# EAGLE design piezo-preamp-tickler_V2-RevG (EAGLE 8.3.1)

## Sheet 1 of 2
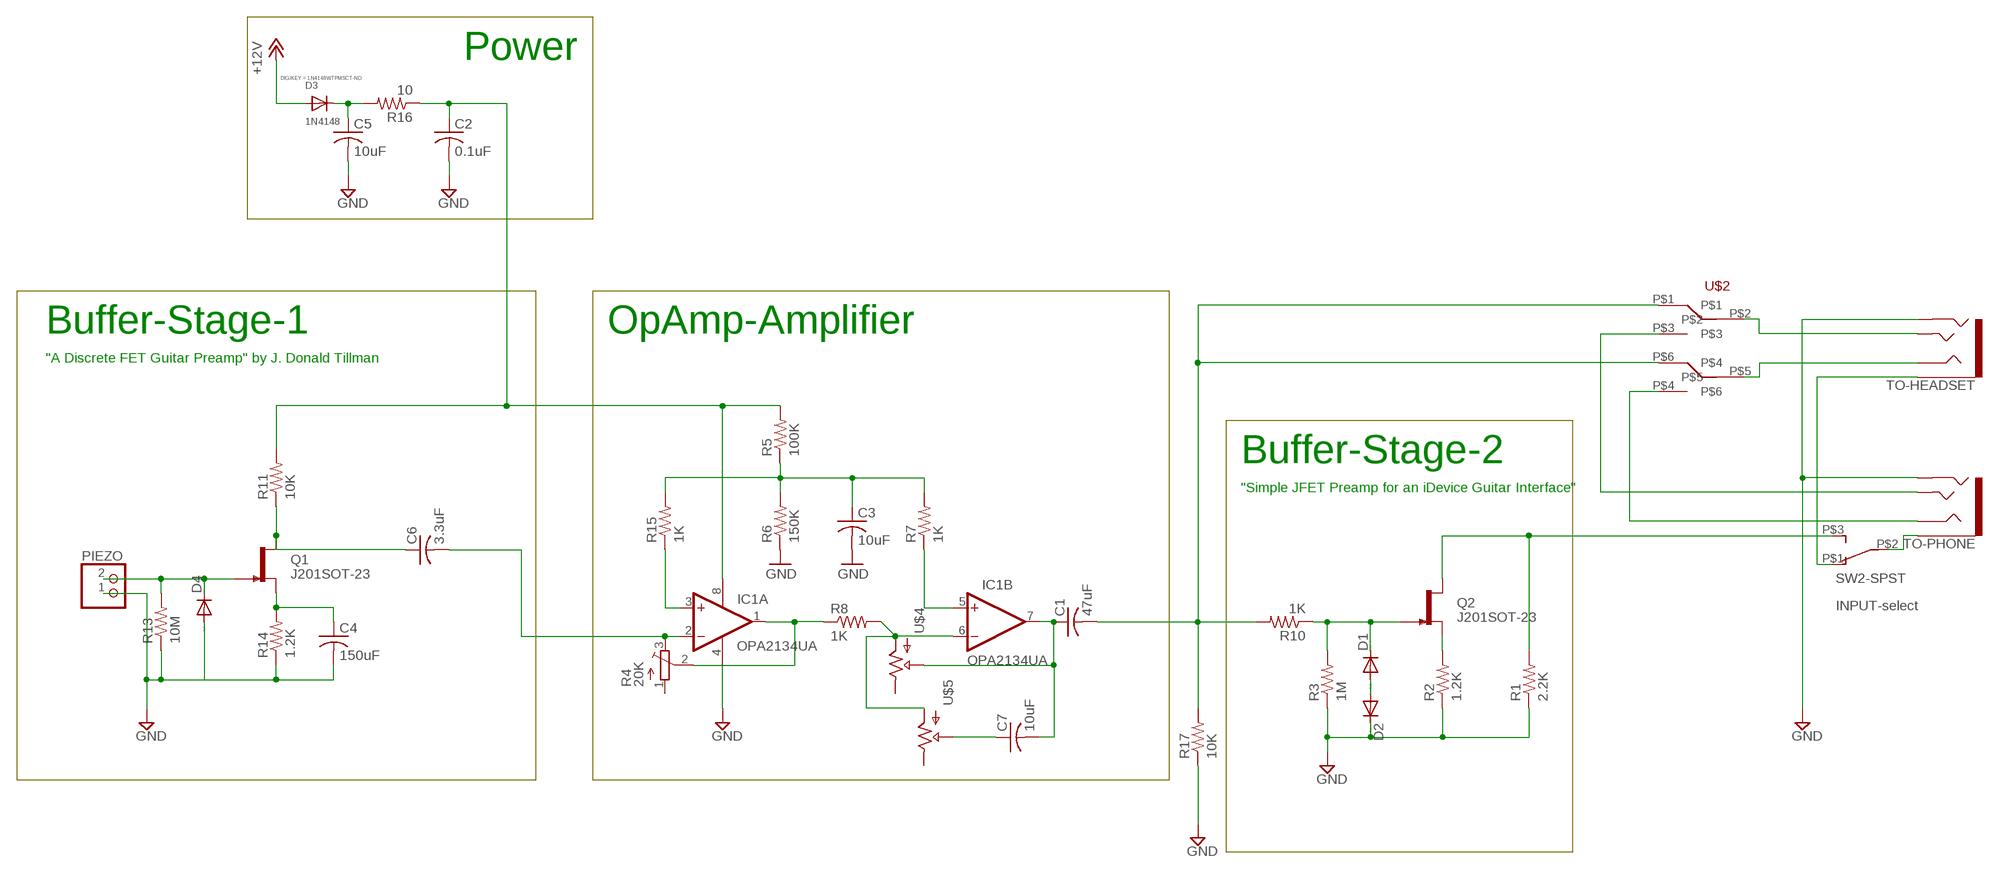
[diagram p0: schematic, sheet 1]

### Parts
C1  47uF  C-US  [CT7343]
C2  0.1uF  C-USC0805K  [C0805K]
C3  10uF  C-USC0805K  [C0805K]
C4  150uF  C-US  [CT7343]
C5  10uF  C-USC0805K  [C0805K]
C6  3.3uF  C-US  [CT7343]
C7  10uF  C-USC0805K  [C0805K]
D1  DIODE-SOD123  [SOD123]
D2  DIODE-SOD123  [SOD123]
D3  1N4148  DIODESOD-123  [SOD-123]
D4  DIODE-SOD123  [SOD123]
IC1  OPA2134UA  [SO08]
PIEZO  JST_2PIN-THM  [JST-PH-2-THM]
Q1  J201SOT-23  [SOT23-3]
Q2  J201SOT-23  [SOT23-3]
R1  2.2K  R-US_R0603  [R0603]
R2  1.2K  R-US_R0603  [R0603]
R3  1M  R-US_R0603  [R0603]
R4  20K  TRIMPOTTC33X  [TC33X]
R5  100K  R-US_R0603  [R0603]
R6  150K  R-US_R0603  [R0603]
R7  1K  R-US_R0603  [R0603]
R8  1K  R-US_R0603  [R0603]
R10  1K  R-US_R0603  [R0603]
R11  10K  R-US_R0603  [R0603]
R13  10M  R-US_R0603  [R0603]
R14  1.2K  R-US_R0603  [R0603]
R15  1K  R-US_R0603  [R0603]
R16  10  R-US_R0603  [R0603]
R17  10K  R-US_R0603  [R0603]
SW2-SPST  INPUT-select  SWITCH_SPDTCL-SB-12B  [SWITCH_SPDT_CL-SB-12B]
TO-HEADSET  AUDIO-JACK3LGPADS  [AUDIO-JACK-TRRS-SMD]
TO-PHONE  AUDIO-JACK3LGPADS  [AUDIO-JACK-TRRS-SMD]
U$2  SWITCH_DPDT  [SWITCH_DPDT_CL-SB-12B]
U$4  POTTHUMBPOT14MM  [THUMBPOT10MM]
U$5  POTTHUMBPOT14MM  [THUMBPOT10MM]

### Nets
+12V: D3.A ; also sheet 2
GND: C2.2 C3.2 C4.- C5.2 D2.C D4.A IC1.4(A:V-) PIEZO.1 R1.1 R2.1 R3.1 R6.1 R13.1 R14.1 R17.1 TO-HEADSET.RING2 TO-PHONE.RING2 ; also sheet 2
N$1: D1.A D2.A
N$2: D4.C PIEZO.2 Q1.3(G) R13.2
N$3: Q2.2(S) R2.2
N$5: IC1.5(B:+IN) R7.1
N$6: C1.+ C7.2 IC1.7(B:OUT) U$4.P$2(WIPER)
N$7: IC1.6(B:-IN) R8.2 U$4.P$1(IN) U$5.P$1(IN)
N$9: C6.+ Q1.1(D) R11.1
N$10: D1.C Q2.3(G) R3.2 R10.1
N$11: C1.- R10.2 R17.2 U$2.P$1 U$2.P$6
N$12: SW2-SPST.P$1 TO-HEADSET.EARTH
N$13: TO-HEADSET.TIP U$2.P$2
N$14: C4.+ Q1.2(S) R14.2
N$15: TO-HEADSET.RING1 U$2.P$5
N$16: C5.1 D3.C R16.2
N$17: SW2-SPST.P$2 TO-PHONE.EARTH
N$22: IC1.3(A:+IN) R15.1
N$23: C3.1 R5.1 R6.2 R7.2 R15.2
N$24: IC1.1(A:OUT) R4.2(S) R8.1
N$25: C2.1 IC1.8(A:V+) R5.2 R11.2 R16.1
N$26: TO-PHONE.RING1 U$2.P$4
N$27: TO-PHONE.TIP U$2.P$3
N$28: C6.- IC1.2(A:-IN) R4.3(E)
N$31: C7.1 U$5.P$2(WIPER)
SELECT: Q2.1(D) R1.2 SW2-SPST.P$3
Unconnected: R4.1(A) U$4.P$3(OUT) U$5.P$3(OUT)

### Notes on the sheet
- Power
- Buffer-Stage-1 | OpAmp-Amplifier
- "A Discrete FET Guitar Preamp" by J. Donald Tillman
- Buffer-Stage-2
- "Simple JFET Preamp for an iDevice Guitar Interface"

## Sheet 2 of 2
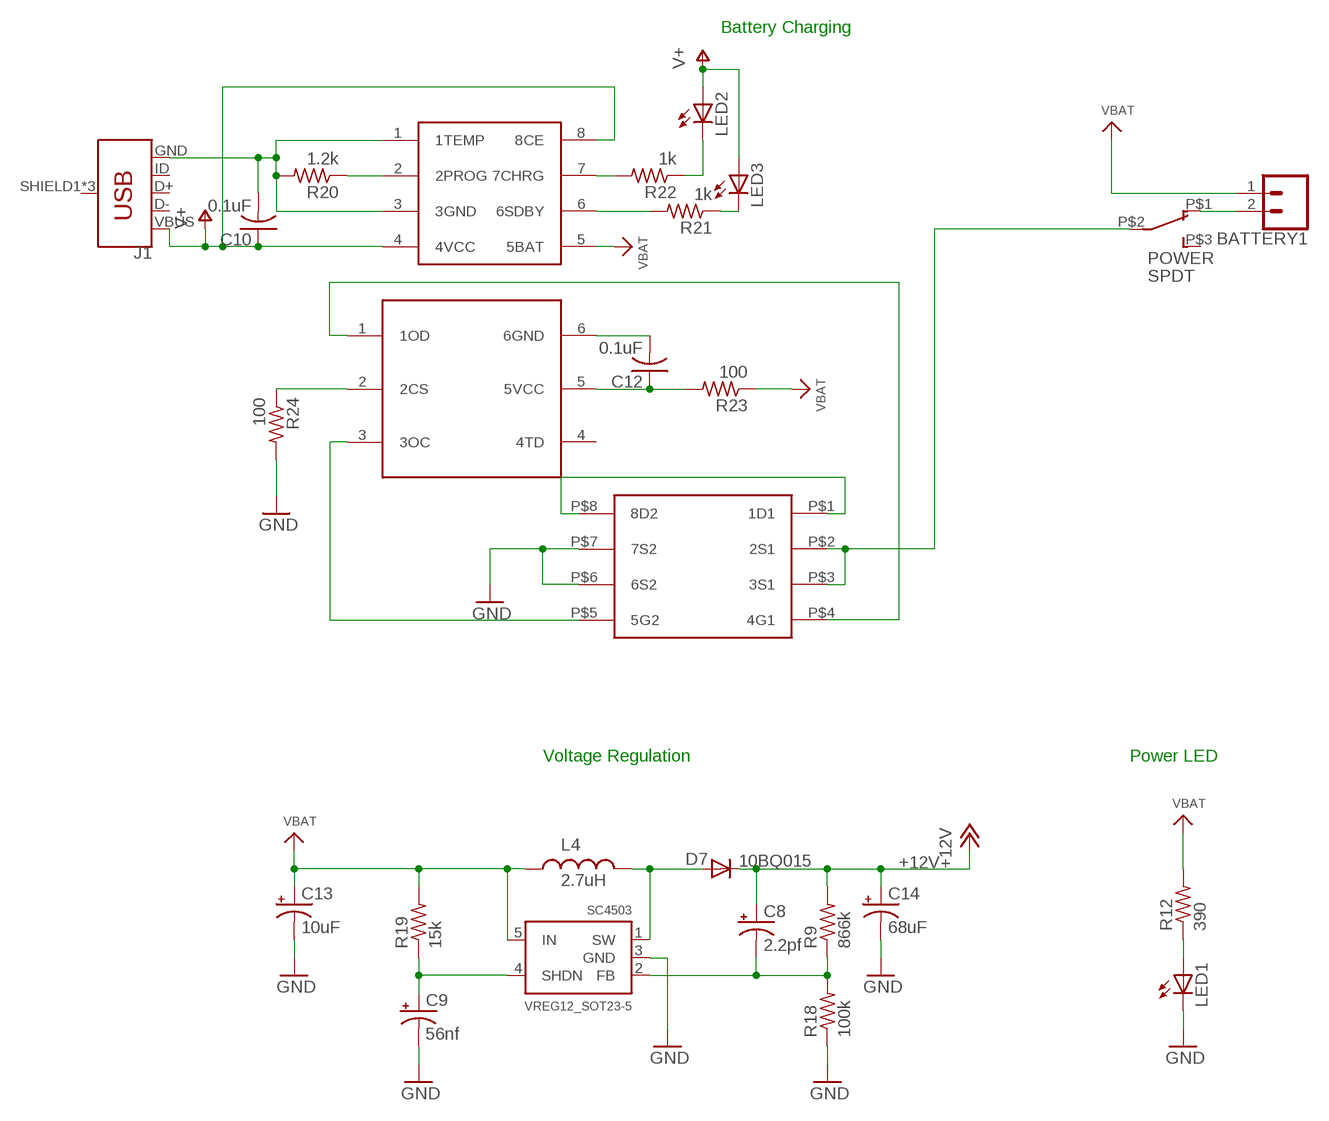
[diagram p1: schematic, sheet 2]

### Parts
BATTERY1  CONN_02LOCK  [1X02_LOCK]
C8  2.2pf  CAP_POL1206  [EIA3216]
C9  56nf  CAP_POL3528  [EIA3528]
C10  0.1uF  C-USC0805K  [C0805K]
C12  0.1uF  C-USC0805K  [C0805K]
C13  10uF  CAP_POL1206  [EIA3216]
C14  68uF  CAP_POL3528  [EIA3528]
D7  10BQ015  DIODESMA  [SMA-DIODE]
DW01A  DW01A  [SOT23-6]
F8205A  F8205A  [F8205A]
J1  USB_MICRO-BREDUCED_PASTE  [USB-B-MICRO-SMD_RED_PASTE]
L4  2.7uH  INDUCTORCR54  [CR54]
LED1  LED3MM  [LED3MM]
LED2  LED3MM  [LED3MM]
LED3  LED3MM  [LED3MM]
POWER  SPDT  SWITCH_SPDTCL-SB-12B  [SWITCH_SPDT_CL-SB-12B]
R9  866k  R-US_R0603  [R0603]
R12  390  R-US_R0805  [R0805]
R18  100k  R-US_R0603  [R0603]
R19  15k  R-US_R0603  [R0603]
R20  1.2k  R-US_R0603  [R0603]
R21  1k  R-US_R0603  [R0603]
R22  1k  R-US_R0603  [R0603]
R23  100  R-US_R0603  [R0603]
R24  100  R-US_R0603  [R0603]
SC4503  VREG12_SOT23-5  [SOT23-5]
TP4056  TP4056-CHIP  [SO08]

### Nets
+12V: C8.A(+) C14.A(+) D7.C R9.2 ; also sheet 1
GND: C9.C(-) C13.C(-) C14.C(-) F8205A.P$6(6S2) F8205A.P$7(7S2) LED1.K(C) R18.1 R24.2 SC4503.3(GND) ; also sheet 1
N$18: LED1.A R12.1
N$20: F8205A.P$2(2S1) F8205A.P$3(3S1) POWER.P$2
N$21: BATTERY1.2 POWER.P$1
N$29: C9.A(+) R19.1 SC4503.4(SHDN)
N$30: C8.C(-) R9.1 R18.2 SC4503.2(FB)
N$32: D7.A L4.P$2 SC4503.1(SW)
N$33: C10.2 J1.GND R20.2 TP4056.1(1TEMP) TP4056.3(3GND)
N$34: DW01A.1(1OD) F8205A.P$4(4G1)
N$35: R20.1 TP4056.2(2PROG)
N$36: DW01A.3(3OC) F8205A.P$5(5G2)
N$37: R22.2 TP4056.7(7CHRG)
N$38: R21.2 TP4056.6(6SDBY)
N$39: LED3.K(C) R21.1
N$40: LED2.K(C) R22.1
N$41: C12.1 DW01A.5(5VCC) R23.2
N$42: C12.2 DW01A.6(6GND)
N$43: DW01A.2(2CS) R24.1
N$44: F8205A.P$1(1D1) F8205A.P$8(8D2)
V+: C10.1 J1.VBUS LED2.A LED3.A TP4056.4(4VCC) TP4056.8(8CE)
VBAT: BATTERY1.1 C13.A(+) L4.P$1 R12.2 R19.2 R23.1 SC4503.5(IN) TP4056.5(5BAT)
Unconnected: DW01A.4(4TD) J1.D+ J1.D- J1.ID J1.SHIELD1(SHIELD) J1.SHIELD2(SHIELD) J1.SHIELD3(SHIELD) POWER.P$3

### Notes on the sheet
- Battery Charging
- Voltage Regulation | Power LED

## Library data of the parts
BATTERY1 = SparkFun-Connectors:CONN_02: Multi connection point. Often used as Generic Header-pin footprint for 0.1 inch spaced/style header connections On any of the 0.1 inch spaced packages, you can populate with these: Break Away Headers - Straight <https://www.sparkfun.com/products/116> (PRT-00116) Break Away Male Headers - Right Angle <https://www.sparkfun.com/products/553> (PRT-00553) Female Headers <https://www.sparkfun.com/products/115> (PRT-00115) Break Away Headers - Machine Pin <https://www.sparkfun.com/products/117> (PRT-00117) Break Away Female Headers - Swiss Machine Pin <https://www.sparkfun.com/products/743> (PRT-00743) For SCREWTERMINALS and SPRING TERMINALS visit here: Screw Terimnals on SparkFun.com <https://www.sparkfun.com/search/results?term=Screw+Terminals> (5mm/3.5mm/2.54mm spacing) This device is also useful as a general connection point to wire up your design to another part of your project. Our various solder wires solder well into these plated through hole pads. Hook-Up Wire - Assortment (Stranded, 22 AWG) <https://www.sparkfun.com/products/11375> (PRT-11375) Hook-Up Wire - Assortment (Solid Core, 22 AWG) <https://www.sparkfun.com/products/11367> (PRT-11367) View the entire wire category on our website here <https://www.sparkfun.com/categories/141> Special notes: Molex polarized connector foot print use with: PRT-08233 with associated crimp pins and housings. 2.54_SCREWTERM for use with PRT-10571. 3.5mm Screw Terminal footprints for PRT-08084 5mm Screw Terminal footprints for use with PRT-08432
C1-C7 C10 C12 = adafruit:C-US: CAPACITOR, American symbol
C8 C9 C13 C14 = SparkFun:CAP_POL: Capacitor Polarized These are standard SMD and PTH capacitors. Normally 10uF, 47uF, and 100uF in electrolytic and tantalum varieties. Always verify the external diameter of the through hole cap, it varies with capacity, voltage, and manufacturer. The EIA devices should be standard.
D1 D2 D4 = diode:DIODE-: DIODE
D3 = adafruit:DIODE: Diode; DIGIKEY: 1N4148WTPMSCT-ND
D7 = SparkFun:DIODE: Diode
DW01A = CMU-ArtFab:DW01A
F8205A = CMU-ArtFab:F8205A
IC1 = linear:OPA2*: Dual Operational Amplifier Low Power, Single-Supply, Rail-To-Rail Operational Amplifier Source: http://focus.ti.com/lit/ds/symlink/opa2345.pdf http://focus.ti.com .. opa241.pdf http://focus.ti.com/lit/ds/symlink/opa2134.pdf
J1 = SparkFun-Connectors:USB_MICRO-B: USB Type Micro-B Connector Male/female and PTH/SMT variants SparkFun Products: SparkFun microB USB Breakout <https://www.sparkfun.com/products/12035> SparkFun USB microB Plug Breakout <https://www.sparkfun.com/products/10031> SparkFun ESP8266 Thing <https://www.sparkfun.com/products/13231>; PROD_ID: CONN-11752
L4 = SparkFun:INDUCTOR: Inductors Basic Inductor/Choke - 0603 and 1206. Footprints are not proven and vary greatly between part numbers.
LED1-LED3 = led:LED: LED OSRAM: - CHIPLED LG R971, LG N971, LY N971, LG Q971, LY Q971, LO R971, LY R971 LH N974, LH R974 LS Q976, LO Q976, LY Q976 LO Q996 - Hyper CHIPLED LW Q18S LB Q993, LB Q99A, LB R99A - SideLED LS A670, LO A670, LY A670, LG A670, LP A670 LB A673, LV A673, LT A673, LW A673 LH A674 LY A675 LS A676, LA A676, LO A676, LY A676, LW A676 LS A679, LY A679, LG A679 - Hyper Micro SIDELED® LS Y876, LA Y876, LO Y876, LY Y876 LT Y87S - SmartLED LW L88C, LW L88S LB L89C, LB L89S, LG L890 LS L89K, LO L89K, LY L89K LS L896, LA L896, LO L896, LY L896 - TOPLED LS T670, LO T670, LY T670, LG T670, LP T670 LSG T670, LSP T670, LSY T670, LOP T670, LYG T670 LG T671, LOG T671, LSG T671 LB T673, LV T673, LT T673, LW T673 LH T674 LS T676, LA T676, LO T676, LY T676, LB T676, LH T676, LSB T676, LW T676 LB T67C, LV T67C, LT T67C, LS T67K, LO T67K, LY T67K, LW E67C LS E67B, LA E67B, LO E67B, LY E67B, LB E67C, LV E67C, LT E67C LW T67C LS T679, LY T679, LG T679 LS T770, LO T770, LY T770, LG T770, LP T770 LB T773, LV T773, LT T773, LW T773 LH T774 LS E675, LA E675, LY E675, LS T675 LS T776, LA T776, LO T776, LY T776, LB T776 LHGB T686 LT T68C, LB T68C - Hyper Mini TOPLED® LB M676 - Mini TOPLED Santana® LG M470 LS M47K, LO M47K, LY M47K Source: http://www.osram.convergy.de LUXEON: - LUMILED® LXK2-PW12-R00, LXK2-PW12-S00, LXK2-PW14-U00, LXK2-PW14-V00 LXK2-PM12-R00, LXK2-PM12-S00, LXK2-PM14-U00 LXK2-PE12-Q00, LXK2-PE12-R00, LXK2-PE12-S00, LXK2-PE14-T00, LXK2-PE14-U00 LXK2-PB12-K00, LXK2-PB12-L00, LXK2-PB12-M00, LXK2-PB14-N00, LXK2-PB14-P00, LXK2-PB14-Q00 LXK2-PR12-L00, LXK2-PR12-M00, LXK2-PR14-Q00, LXK2-PR14-R00 LXK2-PD12-Q00, LXK2-PD12-R00, LXK2-PD12-S00 LXK2-PH12-R00, LXK2-PH12-S00 LXK2-PL12-P00, LXK2-PL12-Q00, LXK2-PL12-R00 Source: www.luxeon.com KINGBRIGHT: KA-3528ASYC Source: www.kingbright.com
PIEZO = adafruit:JST_2PIN: JST 2-Pin Connectors of various flavors SMT-RA (S2B-PH-SM4) 4UConnector #17311 SMT (B2B-PH-SM4) THM-RA (S2B-PH) THM (B2B-PH)
POWER SW2-SPST = CMU-ArtFab:SWITCH_SPDT
Q1 Q2 = CMU-ArtFab:J201: N-channel JFET
R1-R3 R5-R24 = CMU-ArtFab:R-US_: RESISTOR, American symbol
R4 = adafruit:TRIMPOT: SMT trimmer potentiometer part number TC33X http://www.ladyada.net/library/eagle
SC4503 = CMU-ArtFab:VREG12_SOT23-5: SOT23-5 Fixed Voltage Regulators To better organise some of the SOT23-5 fixed voltage regulators in this library, this new part was created. Part Current Out V Out V In V Dropout Digikey Part No. ADP121 150mA 3.3V 3.4-5.5V 0.09V @ 150mA ADP121-AUJZ33R7CT-ND ADP121 150mA 3.0V 3.1-5.5V 0.09V @ 150mA ADP121-AUJZ30R7CT-ND ADP122 300mA 3.3V 3.4-5.5V 0.085V @ 300mA ADP122AUJZ-3.3-R7CT-ND ADP1712 300mA 3.3V 3.5-5.5V 0.17V @ 300mA ADP1712AUJZ-3.3-R7TR-ND AP7311 (Low Cost) 150mA 3.3V 3.5-6V 0.15V @ 150mA AP7311-33WG-7DICT-ND LD39015M18R 150mA 1.8V 1.9V-5.5V 0.08V @ 100mA 497-6977-1-ND MCP1824T-3302E/OT 300mA 3.3V 3.5V-6V 0.2V @ 300mA MCP1824T-3302E/OTCT-ND MIC5205-2.5YM5 TR 150mA 2.5V 2.7-16V 0.165V @ 150mA 576-1257-2-ND MIC5205-3.0YM5 TR 150mA 3.0V 3.2V-16V 0.165V @ 150mA 576-1258-2-ND MIC5205-3.3YM5 TR 150mA 3.3V 3.5V-16V 0.165V @ 150mA 576-1259-2-ND TPS780330220 150mA 3.3V+2.2V 3.6-5.5V 250mV Max 296-23332-1-ND TDA3663/N1,135 100mA 3.3V 3.5-45V 0.18V @ 50mA 568-5343-1-ND
TO-HEADSET TO-PHONE = Daniel:AUDIO-JACK3: Audio jack - 3.5mm TRRS variety - two rings.
TP4056 = CMU-ArtFab:TP4056-CHIP
U$2 = CMU-ArtFab:SWITCH_DPDT
U$4 U$5 = CMU-ArtFab:POT

## Board
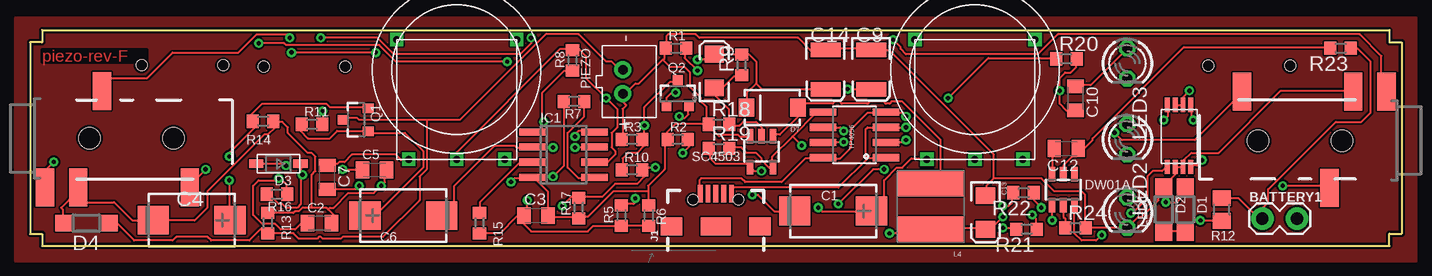
[diagram p2: board, top side]
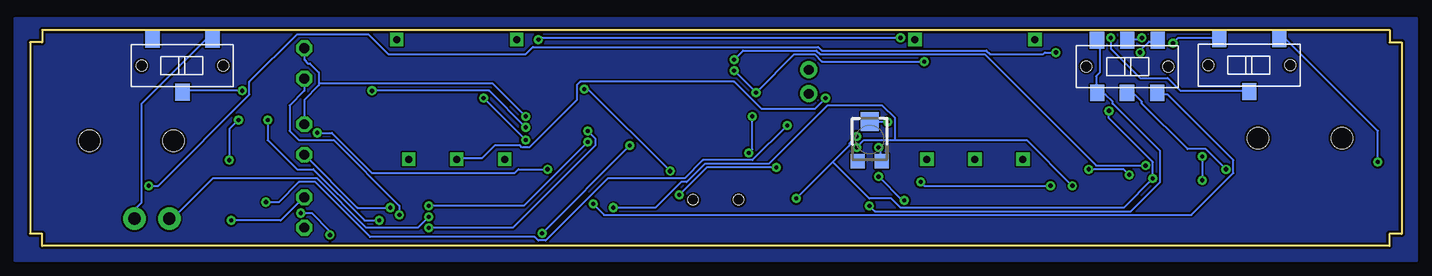
[diagram p3: board, bottom side, seen from below]

Size 114.3 x 18.03 mm. Coordinates in mm from the lower left corner, seen from the top.
Outline: 0,17 0,1 1.02,1 1.02,0 113.28,0 113.28,1.02 114.3,1.02 114.3,17 113.28,17 113.28,18.03 1,18.03 1,17 0,17
Copper layers (1*16): Top 0.035mm / dielectric 1.5mm / Bottom 0.035mm
Design rules "default *": minimum track width 6mil, minimum drill 0.35mm, track to track 6mil, track to pad 6mil, pad to pad 6mil, via to via 6mil, smd to smd 6mil, copper to edge 8mil, drill to drill 6mil, minimum pad ring 10mil, minimum via ring 8mil, stop-mask expansion 4mil, vias tented up to drill 20mil, thermal gap 10mil

### Footprints (pad centres in the part's own frame; a part is rotated, then mirrored left to right if it is on the bottom)
1X02_LOCK = drill 1.016 pad 1.88: 1 -0.178,0; 2 2.718,0
CT7343 = smd 2.6 x 2.4: + 3.2,0; - -3.2,0
C0805K = smd 1.1 x 1.4: 1 -1,0; 2 1,0
EIA3216 = smd 1.4 x 1.6: A 1.4,0; C -1.4,0
EIA3528 = smd 1.2 x 2.5: A 1.65,0; C -1.65,0
SOD123 = smd 1.4 x 1.4: A 1.9,0; C -1.9,0
SOD-123 = smd 1.2 x 0.7: A 1.85,0; C -1.85,0
SMA-DIODE = smd 1.27 x 1.47: A -2.15,0; C 2.15,0
SOT23-6 = smd 0.55 x 1.2: 1 -0.95,-1.3; 2 0,-1.3; 3 0.95,-1.3; 4 0.95,1.3; 5 0,1.303; 6 -0.95,1.3
F8205A = smd 0.406 x 1.2: P$1 -0.975,-2.65; P$2 -0.325,-2.65; P$3 0.325,-2.65; P$4 0.975,-2.65; P$5 0.975,2.55; P$6 0.325,2.55; P$7 -0.325,2.55; P$8 -0.975,2.55
SO08 = smd 0.6 x 2.2: 1 -1.905,-2.6; 2 -0.635,-2.6; 3 0.635,-2.6; 4 1.905,-2.6; 5 1.905,2.6; 6 0.635,2.6; 7 -0.635,2.6; 8 -1.905,2.6
USB-B-MICRO-SMD_RED_PASTE = smd 1.45 x 0.4: D+ 2.725,0; D- 2.725,0.65; GND 2.725,-1.3; ID 2.725,-0.65; VBUS 2.725,1.3 | smd 1.5 x 1.8: SHIELD1 0,3.685; SHIELD2 0,-3.685 | smd 1.5 x 2.5: SHIELD3 0,0 | hole 0.85: 2.2,1.9; 2.2,-1.9
CR54 = smd 5.5 x 2.15: P$1 0,1.92; P$2 0,-1.92
LED3MM = drill 0.813 octagon: A -1.27,0; K 1.27,0
JST-PH-2-THM = drill 0.8 pad 1.422: 1 1,0; 2 -1,0
SWITCH_SPDT_CL-SB-12B = smd 1.2 x 1.4: P$1 -2.5,-2.2; P$2 0,2.2; P$3 2.5,-2.2 | hole 0.9: -3.4,0; 3.4,0
SOT23-3 = smd 0.8 x 0.9: 1 -0.95,-1; 2 0.95,-1; 3 0,1.1
R0603 = smd 1 x 1.1: 1 -0.85,0; 2 0.85,0
TC33X = smd 1.2 x 1.2: 1 -1,-1.825; 3 1,-1.825 | smd 1.5 x 1.6: 2 0,1.5
R0805 = smd 1.3 x 1.5: 1 -0.95,0; 2 0.95,0
SOT23-5 = smd 0.55 x 1.2: 1 -0.95,-1.3; 2 0,-1.3; 3 0.95,-1.3; 4 0.95,1.3; 5 -0.95,1.3
AUDIO-JACK-TRRS-SMD = smd 1.524 x 3.175: EARTH -2.114,-5.271; RING1 2.644,2.759; RING2 0.66,-5.271; TIP 9.948,-5.271 | hole 1.778: 1.6,-1.15; 8.6,-1.15
SO08' = smd 0.61 x 2.21: 1 -1.905,-2.616; 2 -0.635,-2.616; 3 0.635,-2.616; 4 1.905,-2.616; 5 1.905,2.616; 6 0.635,2.616; 7 -0.635,2.616; 8 -1.905,2.616
SWITCH_DPDT_CL-SB-12B = smd 1.2 x 1.4: P$1 -2.5,-2.2; P$2 -0.04,-2.2; P$3 2.5,-2.2; P$4 2.54,2.2; P$5 0,2.2; P$6 -2.54,2.2 | hole 0.9: -3.4,0; 3.4,0
THUMBPOT10MM = drill 0.6 square: P$1 0,-7.5; P$2 -4,-7.5; P$3 4,-7.5; P$4 -5,2.5; P$5 5,2.5

### Placement (x,y rotation side)
BATTERY1  102.87,2.29 0 top
C1  66.93,2.92 0 top
C2  24.13,1.91 0 top
C3  42.16,2.54 0 top
C4  13.46,2.16 0 top
C5  28.7,6.35 0 top
C6  31.11,2.54 180 top
C7  24.77,5.71 270 top
C8  57.02,14.61 90 top
C9  70.1,14.73 270 top
C10  87.12,12.32 270 top
C12  86.36,8.13 180 top
C13  79.63,2.79 270 top
C14  66.29,14.73 270 top
D1  96.27,3.05 270 top
D2  94.49,3.05 270 top
D3  20.7,6.86 180 top
D4  4.7,1.91 180 top
D7  61.85,11.56 180 top
DW01A  86.11,4.7 0 top
F8205A  95.76,9.14 180 top
IC1  44.45,7.62 270 top
J1  57.15,1.65 90 top
L4  75.06,3.3 180 top
LED1  91.44,2.79 270 top
LED2  91.44,8.89 270 top
LED3  91.44,15.24 270 top
PIEZO  49.4,13.72 270 top
POWER  101.6,15.04 180 bottom
Q1  27.18,10.54 90 top
Q2  53.98,12.7 0 top
R1  53.85,16.51 0 top
R2  53.98,8.89 0 top
R3  50.16,8.89 0 top
R4  44.32,8.89 0 bottom
R5  49.28,2.54 90 top
R6  51.56,2.54 270 top
R7  45.34,12.06 180 top
R8  45.21,15.49 90 top
R9  59.31,15.11 90 top
R10  50.16,6.35 0 top
R11  23.5,10.16 0 top
R12  99.31,3.05 90 top
R13  19.81,1.91 270 top
R14  19.43,10.41 180 top
R15  37.47,1.91 270 top
R16  20.57,4.32 180 top
R17  45.72,3.17 90 top
R18  57.4,10.16 0 top
R19  57.4,8.13 0 top
R20  86.36,15.62 0 top
R21  83.06,1.4 180 top
R22  82.8,4.45 180 top
R23  109.22,16.51 180 top
R24  87.12,1.52 0 top
SC4503  60.96,7.87 180 top
SW2-SPST  12.7,15.08 180 bottom
TO-HEADSET  3.37,10.16 0 top
TO-PHONE  110.94,7.62 180 top
TP4056  TP4056-CHIP  [SO08']  68.71,9.27 90 top
U$2  22.86,14.99 0 bottom
U$4  78.74,14.73 0 top
U$5  35.56,14.73 0 top

### Tracks (layer width: path | path; a pad name or v marks a point on that pad's centre or on a via)
+12V  (via drill 0.35)
  Top 0.152: D3.A 21.18,6.86 v21.34,6.71 | v55.63,15.54 56.54,15.54 57,16 C8.A 57.15,16 59.28,16 R9.2 59.44,16 59.89,16 60.5,15.39 60.5,13.56 | 60.5,13.56 59.74,12.8 59.74,11.58 D7.C | 60.5,13.56 60.96,13.11 66.29,13.11 C14.A
  Bottom 0.152: v21.34,6.71 25.45,6.71 34.75,16 48.46,16 48.77,16.31 54.86,16.31 v55.63,15.54
GND  (via drill 0.35)
  Top 0.152: 3.81,4.42 3.96,4.57 3.96,4.88 TO-HEADSET.RING2 3.81,4.42 | 3.81,4.42 2.59,3.2 2.74,3.05 2.74,1.98 D4.A | 3.81,4.42 4.57,3.66 7.01,3.66 8.53,2.13 10.21,2.13 C4.- 10.36,2.13 13.72,2.13 14.78,3.2 14.78,4.57 19.51,9.3 19.81,9.3 20.42,9.91 20.42,10.36 | 23.47,3.2 24.69,3.2 24.84,3.05 | 23.47,3.2 22.71,3.2 22.4,2.9 22.1,2.9 21.95,2.74 R13.1 | 24.84,3.05 25.3,2.59 25.3,2.13 25.15,1.98 C2.2 | 20.42,10.36 21.03,10.36 21.49,9.91 21.49,9.45 23.16,7.77 23.47,7.77 23.77,7.47 23.77,6.25 23.47,5.94 23.47,3.2 | 24.84,3.05 24.99,3.2 25.3,3.2 26.52,4.42 28.65,4.42 v29.26,5.03 29.57,5.33 29.57,6.25 C5.2 | 20.42,10.36 R14.1 | R3.1 49.38,8.99 49.38,11.43 49.68,11.73 49.38,12.04 49.38,12.65 PIEZO.1 49.53,12.65 50.44,13.56 50.75,13.56 52.73,15.54 | 52.73,15.54 52.88,15.7 52.88,16.46 R1.1 53.03,16.61 53.03,17.53 53.19,17.68 55.47,17.68 55.78,17.37 64.01,17.37 65.08,16.31 66.29,16.31 C14.C 66.29,16.46 70.1,16.46 C9.C 70.1,16.31 71.63,16.31 80.31,7.62 80.31,5.64 | 45.72,2.44 43.28,2.44 C3.2 43.13,2.59 43.13,4.57 41.91,5.79 IC1.4 41.76,5.64 40.39,5.64 v40.08,5.33 | 51.51,4.57 51.51,5.03 52.88,6.4 52.88,8.69 53.03,8.84 R2.1 53.03,8.99 53.03,9.45 53.8,10.21 56.39,10.21 | 51.51,4.57 51.51,3.5 R6.1 | 56.39,10.21 56.54,10.21 R18.1 | SC4503.3 59.89,9.14 59.13,9.14 58.98,9.3 57.61,9.3 57.45,9.14 56.54,10.06 R18.1 | 45.72,2.44 46.48,2.44 48.62,4.57 51.51,4.57 | 45.72,2.44 R17.1 | 52.73,15.54 53.34,14.94 54.56,14.94 55.02,14.48 55.02,13.26 55.93,12.34 55.78,12.19 56.39,11.58 56.39,10.21 | 56.39,10.21 R18.1 | 80.31,5.64 79.7,5.03 79.7,4.27 C13.C | 80.31,5.64 84.28,5.64 85.34,4.57 87.63,4.57 87.94,4.27 87.94,1.52 R24.2 LED1.K 92.35,2.44 92.66,2.44 94.03,3.81 94.03,3.96 94.49,4.42 D2.C 94.49,5.03 95.4,5.94 95.4,6.55 F8205A.P$6 95.56,6.55 96.01,6.55 F8205A.P$7 96.16,6.71 96.16,7.16 96.77,7.77 99.06,7.77 104.24,12.95 110.19,12.95 TO-PHONE.RING2
  Bottom 0.152: v29.26,5.03 39.78,5.03 v40.08,5.33
N$1
  Top 0.152: D2.A 94.49,1.22 96.16,1.22 D1.A
N$2
  Top 0.152: 33.07,10.52 35.81,10.52 42.98,17.68 45.72,17.68 48.01,15.39 48.46,15.39 49.07,14.78 49.38,14.78 PIEZO.2 | 33.07,10.52 27.43,10.52 27.28,10.67 26.21,10.67 Q1.3 | R13.2 21.95,1.07 22.4,0.61 23.93,0.61 24.08,0.76 24.23,0.76 24.38,0.61 25.91,0.61 26.06,0.76 29.41,0.76 32.46,3.81 32.46,5.79 33.07,6.4 33.07,10.52 | R13.2 19.51,1.37 19.2,1.37 18.29,0.46 15.09,0.46 14.78,0.76 12.19,0.76 11.89,0.46 8.69,0.46 7.32,1.83 6.71,1.83 D4.C | R13.2
N$3  (via drill 0.35)
  Top 0.152: v54.1,10.82 54.25,10.67 54.56,10.67 54.86,10.97 54.86,11.58 Q2.2 | v54.41,7.77 55.02,8.38 55.02,8.69 54.86,8.84 R2.2
  Bottom 0.152: v54.1,10.82 54.1,8.08 v54.41,7.77
N$4
  pour Top: -1.27,19.05 -1.27,-1.27 115.57,-1.27 115.57,19.05
N$5
  Top 0.152: R7.1 46.18,12.04 46.18,10.82 44.81,9.45 44.81,6.55 45.72,5.64 46.94,5.64 IC1.5
N$6  (via drill 0.35)
  Top 0.152: U$4.P$2 74.68,7.32 73.46,7.32 72.69,6.55 72.24,6.55 71.17,5.49 71.17,3.96 70.26,3.05 C1.+ 70.1,2.9 65.99,2.9 v65.68,3.2 | v27.43,5.03 27.13,4.72 24.84,4.72 C7.2 | v45.41,8.23 46.94,8.23 IC1.7
  Bottom 0.152: v27.43,5.03 31.24,8.84 42.22,8.84 | 42.22,8.84 44.81,8.84 v45.41,8.23 | v65.68,3.2 62.18,3.2 60.05,5.33 59.59,5.33 58.06,6.86 52.73,6.86 47.85,11.73 43.28,11.73 42.22,10.67 42.22,8.84
N$7  (via drill 0.35)
  Top 0.152: U$5.P$1 35.51,7.32 35.51,7.77 44.2,16.46 45.11,16.46 R8.2 45.26,16.46 45.72,16.46 46.33,15.85 46.33,14.02 v48.01,12.34 48.92,11.43 48.92,9.91 48.46,9.45 48.46,8.23 48.77,7.92 48.77,7.62 48.16,7.01 47.09,7.01 IC1.6
  Bottom 0.152: v48.01,12.34 48.92,11.43 53.34,11.43 55.63,13.72 68.43,13.72 68.73,13.41 68.73,12.19 72.69,8.23 73.3,8.23 73.46,8.38 75.59,8.38 76.66,7.32 78.64,7.32 U$4.P$1
N$8
  pour Bottom: -1.27,19.05 -1.27,-1.27 115.57,-1.27 115.57,19.05
N$9
  Top 0.152: R11.1 22.55,10.06 22.55,9.6 23.16,8.99 24.99,8.99 25.6,9.6 28.04,9.6 Q1.1 28.19,9.45 31.24,9.45 32.77,7.92 32.77,6.55 28.8,2.59 28.04,2.59 C6.+
N$10  (via drill 0.35)
  Top 0.152: Q2.3 53.95,13.72 53.34,13.72 51.21,11.58 v51.21,10.06 51.21,9.14 51.05,8.99 R3.2 51.05,8.84 51.21,8.69 51.21,8.38 50.6,7.77 49.84,7.77 49.38,7.32 49.38,6.4 R10.1 | v94.64,3.66 95.56,3.66 96.16,4.27 96.16,4.88 D1.C
  Bottom 0.152: v94.64,3.66 93.57,3.66 91.9,5.33 90.53,5.33 85.95,0.76 72.24,0.76 71.93,0.46 71.32,0.46 66.14,5.64 59.74,5.64 58.22,7.16 54.1,7.16 v51.21,10.06
N$11  (via drill 0.35)
  Top 0.152: 45.72,4.12 47.7,4.12 48.77,5.18 50.6,5.18 51.21,5.79 51.21,6.1 51.05,6.25 R10.2 51.05,6.4 51.21,6.55 v52.12,6.55 | v60.2,4.27 60.66,4.27 62.03,2.9 63.7,2.9 C1.- | v44.35,3.35 45.11,4.12 45.72,4.12 | 45.72,4.12 R17.2
  Bottom 0.152: U$2.P$6 25.3,17.07 25.15,16.92 25.15,14.48 25.45,14.17 25.45,12.8 U$2.P$1 25.3,12.65 24.69,12.65 24.08,12.04 24.08,11.89 20.12,7.92 20.12,5.33 22.55,2.9 43.89,2.9 v44.35,3.35 | v60.2,4.27 57.91,6.55 v52.12,6.55
N$12  (via drill 0.35)
  Top 0.152: v1.98,7.01 1.37,6.4 1.37,5.03 TO-HEADSET.EARTH
  Bottom 0.152: v1.98,7.01 1.98,9.6 9.6,17.22 10.06,17.22 SW2-SPST.P$1
N$13  (via drill 0.35)
  Top 0.152: v14.63,6.4 13.26,5.03 TO-HEADSET.TIP
  Bottom 0.152: v14.63,6.4 16.31,8.08 17.83,8.08 21.64,11.89 21.64,12.04 22.25,12.65 22.86,12.65 U$2.P$2
N$14  (via drill 0.35)
  Top 0.152: Q1.2 28.04,11.58 24.99,11.58 24.69,11.89 19.36,11.89 18.44,10.97 18.44,10.52 R14.2 18.59,10.36 18.75,10.21 18.75,9.91 16.61,7.77 v16.61,7.47 | v16.61,5.49 16.61,2.29 C4.+
  Bottom 0.152: v16.61,7.47 v16.61,5.49
N$15  (via drill 0.35)
  Top 0.152: v21.64,17.37 21.64,17.53 21.49,17.68 18.9,17.68 17.37,16.15 11.89,16.15 9.75,14.02 6.71,14.02 6.1,13.41 6.1,12.95 TO-HEADSET.RING1
  Bottom 0.152: v21.64,17.37 21.79,17.22 22.86,17.22 U$2.P$5
N$16  (via drill 0.35)
  Top 0.152: 22.55,5.94 D3.C | 22.55,5.94 22.55,3.5 22.25,3.2 21.34,3.2 21.03,3.5 20.73,3.5 20.27,3.96 20.12,3.96 19.81,4.27 R16.2 | v26.06,6.4 27.58,6.4 C5.1 | 22.55,5.94 v22.71,5.94
  Bottom 0.152: v26.06,6.4 23.16,6.4 v22.71,5.94
N$17  (via drill 0.35)
  Top 0.152: v24.23,17.37 28.96,17.37 30.33,16 40.84,16 41.76,16.92 v41.76,17.37 | v71.93,17.22 72.54,16.61 72.54,16.46 73,16 83.97,16 85.65,17.68 110.8,17.68 112.62,15.85 112.62,13.26 112.93,12.95 TO-PHONE.EARTH
  Bottom 0.152: v24.23,17.37 24.23,16.46 21.79,14.02 19.51,14.02 18.44,12.95 12.8,12.95 SW2-SPST.P$2 | v41.76,17.37 71.78,17.37 v71.93,17.22
N$18  (via drill 0.35)
  Top 0.152: v97.54,2.13 99.21,2.13 R12.1
  Bottom 0.152: v97.54,2.13 93.42,2.13 91.44,4.12 LED1.A
N$20  (via drill 0.35)
  Top 0.152: F8205A.P$3 95.56,11.73 96.01,11.73 F8205A.P$2 96.01,11.89 96.01,12.34 v96.62,12.95
  Bottom 0.152: v96.62,12.95 101.5,12.95 POWER.P$2
N$21
  Bottom 0.152: POWER.P$1 99.21,17.22 99.67,17.22 105,11.89 105,3.66 105.46,3.2 105.46,2.29 BATTERY1.2
N$22
  Top 0.152: R15.1 37.49,2.9 37.49,3.66 40.69,6.86 41.76,6.86 IC1.3
N$23  (via drill 0.35)
  Top 0.152: R6.2 51.51,1.68 49.38,1.68 R5.1 49.23,1.68 46.94,1.68 46.48,1.22 41.76,1.22 41.15,1.83 41.15,2.44 | 41.15,2.44 40.54,2.44 39.17,1.07 37.49,1.07 R15.2 | v43.59,5.79 44.5,6.71 44.5,12.04 R7.2 | v41.45,3.81 41.45,2.74 41.3,2.59 C3.1 41.15,2.44
  Bottom 0.152: v43.59,5.79 41.6,3.81 v41.45,3.81
N$24  (via drill 0.35)
  Top 0.152: 42.67,10.36 42.67,9.75 42.52,9.6 41.91,9.6 IC1.1 | 42.67,10.36 42.67,12.8 44.5,14.63 45.11,14.63 R8.1 | 42.67,10.36 v42.82,10.36
  Bottom 0.152: v42.82,10.36 44.2,10.36 R4.2
N$25  (via drill 0.35)
  Top 0.152: v50.44,3.96 50.44,3.66 50.29,3.5 49.38,3.5 R5.2 | v45.41,9.14 45.41,9.3 45.72,9.6 46.94,9.6 IC1.8 | 20.73,5.49 19.05,5.49 18.59,5.03 18.59,2.59 19.36,1.83 20.42,1.83 20.88,1.37 22.1,1.37 22.55,1.83 23.01,1.83 C2.1 | 20.73,5.49 21.03,5.49 21.34,5.18 21.34,4.42 R16.1 | v24.38,11.28 24.38,10.21 R11.2 | 20.73,5.49 v20.73,5.64
  Bottom 0.152: 47.4,7.01 46.02,8.38 46.02,8.53 v45.41,9.14 | 47.4,7.01 v50.44,3.96 | v24.38,11.28 24.38,10.67 20.73,7.01 v20.73,5.64 23.16,3.2 41.76,3.2 42.52,3.96 44.35,3.96 47.4,7.01
N$26  (via drill 0.35)
  Top 0.152: v28.8,16.15 v21.79,16.15 | v104.39,5.03 108.05,5.03 108.2,4.88 TO-PHONE.RING1
  Bottom 0.152: v21.79,16.15 21.64,16.31 21.64,16.46 21.03,17.07 20.42,17.07 U$2.P$4 | v28.8,16.15 29.72,16.15 29.87,16 34.29,16 34.59,16.31 48.31,16.31 48.62,16.61 72.39,16.61 73,16 84.43,16 86.11,17.68 92.05,17.68 96.01,13.72 96.01,12.65 103.63,5.03 v104.39,5.03
N$27  (via drill 0.35)
  Top 0.152: v67.36,3.5 70.26,6.4 v71.17,6.4 | v90.37,9.45 90.98,8.84 97.08,8.84 101.04,12.8 TO-PHONE.TIP
  Bottom 0.152: v67.36,3.5 66.45,2.59 17.53,2.59 14.02,6.1 14.02,7.16 19.51,12.65 20.27,12.65 U$2.P$3 | v71.17,6.4 73.61,6.4 73.91,6.1 85.8,6.1 89.15,9.45 v90.37,9.45
N$28  (via drill 0.35)
  Top 0.152: v43.59,8.23 41.91,8.23 IC1.2 41.76,8.23 40.54,8.23 40.39,8.38 38.71,8.38 35.36,5.03 35.36,3.5 34.44,2.59 C6.-
  Bottom 0.152: v43.59,8.23 43.43,8.08 43.43,7.16 R4.3
N$29  (via drill 0.35)
  Top 0.152: R19.1 56.69,8.08 56.69,7.32 57.15,6.86 59.89,6.86 60.05,6.71 SC4503.4 60.05,6.55 60.35,6.25 v60.96,6.25 | v68.12,13.11 70.1,13.11 C9.A
  Bottom 0.152: v68.12,13.11 67.82,13.11 v60.96,6.25
N$30
  Top 0.152: R9.1 59.28,14.17 58.67,14.17 57.76,13.26 57.15,13.26 C8.C 57.15,13.11 57.15,12.5 58.22,11.43 58.22,10.21 R18.2 58.37,10.06 59.13,10.06 59.44,10.36 60.5,10.36 60.96,9.91 SC4503.2
N$31
  Top 0.152: C7.1 24.84,6.86 25.6,6.86 25.76,7.01 26.21,7.01 26.82,7.62 30.48,7.62 30.94,7.16 31.55,7.16 U$5.P$2
N$32
  Top 0.152: SC4503.1 62.03,9.3 62.48,9.3 64.01,10.82 64.01,11.43 D7.A 64.01,11.58 64.31,11.58 64.62,11.89 66.9,11.89 67.06,12.04 67.51,12.04 67.67,11.89 69.8,11.89 69.95,12.04 71.17,12.04 71.32,11.89 71.63,11.89 71.78,12.04 72.69,12.04 75.89,8.84 75.89,6.1 75.13,5.33 L4.P$2
N$33  (via drill 0.35)
  Top 0.152: R20.2 87.17,15.54 87.17,14.94 86.72,14.48 86.26,14.48 85.8,14.02 v85.8,12.95 85.8,11.89 86.41,11.28 87.02,11.28 C10.2 | 69.8,7.32 67.36,4.88 58.67,4.88 58.52,4.72 58.52,4.42 J1.GND | 69.8,7.32 71.32,7.32 TP4056.1 | 69.8,7.32 69.65,7.47 69.65,9.75 69.8,9.91 TP4056.3 v73,9.91
  Bottom 0.152: v85.8,12.95 76.05,12.95 v73,9.91
N$34  (via drill 0.35)
  Top 0.152: v85.19,2.13 85.19,3.35 DW01A.1 | v94.49,10.52 94.79,10.82 94.79,11.73 F8205A.P$4
  Bottom 0.152: v85.19,2.13 86.41,2.13 90.68,6.4 92.05,6.4 94.49,8.84 v94.49,10.52
N$35  (via drill 0.35)
  Top 0.152: v76.5,12.34 79.86,15.7 85.5,15.7 R20.1 | v73,8.84 72.85,8.69 71.32,8.69 TP4056.2
  Bottom 0.152: v73,8.84 v76.5,12.34
N$36  (via drill 0.35)
  Top 0.152: v89.31,0.91 88.85,0.46 87.63,0.46 87.02,1.07 87.02,3.35 DW01A.3 | v91.75,2.74 91.9,2.74 93.12,3.96 93.12,5.79 93.57,6.25 94.34,6.25 94.64,6.55 F8205A.P$5
  Bottom 0.152: v89.31,0.91 89.31,1.22 90.83,2.74 v91.75,2.74
N$37  (via drill 0.35)
  Top 0.152: v81.08,3.35 81.53,3.35 81.84,3.66 81.84,4.42 R22.2 | v67.82,8.69 66.14,8.69 TP4056.7
  Bottom 0.152: v81.08,3.35 73.15,3.35 v67.82,8.69
N$38  (via drill 0.35)
  Top 0.152: v81.08,1.52 82.14,1.52 R21.2 | v67.82,9.6 67.51,9.91 TP4056.6
  Bottom 0.152: v81.08,1.52 74.07,1.52 67.21,8.38 67.21,8.99 v67.82,9.6
N$39  (via drill 0.35)
  Top 0.152: v83.52,2.59 83.82,2.29 83.82,1.52 R21.1
  Bottom 0.152: v83.52,2.59 83.52,3.35 89,8.84 91.9,8.84 92.66,9.6 92.66,11.73 91.44,12.95 LED3.K
N$40  (via drill 0.35)
  Top 0.152: v84.28,3.2 83.67,3.81 83.67,4.42 R22.1
  Bottom 0.152: v84.28,3.2 87.02,3.2 LED2.K
N$41
  Top 0.152: R23.2 108.36,16.61 96.16,16.61 88.54,8.99 88.54,8.84 87.94,8.23 87.48,8.23 C12.1 87.48,8.08 86.11,6.71 DW01A.5
N$42
  Top 0.152: DW01A.6 85.19,6.1 85.19,7.92 85.34,8.08 C12.2
N$43
  Top 0.152: DW01A.2 86.11,2.44 86.26,2.29 86.26,1.52 R24.1
N$44  (via drill 0.35)
  Top 0.152: v97.69,7.16 97.23,6.71 96.77,6.71 F8205A.P$8 | v96.93,10.52 96.77,10.67 96.77,11.73 F8205A.P$1
  Bottom 0.152: v97.69,7.16 97.69,9.75 v96.93,10.52
SELECT  (via drill 0.35)
  Top 0.152: v53.8,12.8 53.49,12.8 53.03,12.34 53.03,11.73 Q2.1 | v55.63,14.63 54.56,15.7 54.56,16.46 R1.2 | v19.05,16.92 21.18,16.92 21.34,16.76 29.11,16.76 30.48,15.39 v39.78,15.39
  Bottom 0.152: v55.63,14.63 v53.8,12.8 50.6,16 48.92,16 48.31,15.39 v39.78,15.39 | v19.05,16.92 18.59,17.37 15.24,17.37 SW2-SPST.P$3
V+  (via drill 0.35)
  Top 0.152: C10.1 87.17,13.41 88.39,13.41 91.44,16.46 LED3.A | J1.VBUS 55.78,4.42 55.78,5.49 55.93,5.64 59.28,5.64 59.59,5.33 62.64,5.33 64.62,7.32 65.99,7.32 TP4056.8 66.14,7.32 67.51,7.32 68.43,8.23 68.43,9.75 69.8,11.12 71.32,11.12 | v73,10.82 73,10.97 72.85,11.12 71.32,11.12 | 71.32,11.12 TP4056.4
  Bottom 0.152: LED2.A 91.44,12.19 90.22,13.41 90.22,13.56 | 90.22,13.56 90.22,14.48 90.98,15.24 91.14,15.24 91.44,15.54 LED3.A | 90.22,13.56 75.74,13.56 v73,10.82
VBAT  (via drill 0.35)
  Top 0.152: 102.72,2.74 102.72,2.29 BATTERY1.1 102.72,2.74 | 102.72,2.74 102.72,3.2 103.17,3.66 103.17,4.72 108.81,10.36 110.95,10.36 111.71,11.12 111.71,15.39 110.64,16.46 110.19,16.46 R23.1 | 102.72,2.74 101.96,2.74 100.74,3.96 99.36,3.96 R12.2 | R19.2 58.37,8.23 59.28,8.23 59.74,7.77 60.5,7.77 60.96,7.32 60.96,7.16 61.57,6.55 61.87,6.55 SC4503.5 61.87,6.71 61.87,7.47 63.55,9.14 | 63.55,9.14 65.53,11.12 65.99,11.12 TP4056.5 | v64.31,8.38 63.55,9.14 | v71.63,1.07 74.68,1.07 74.98,1.37 L4.P$1 75.13,1.52 79.55,1.52 C13.A 79.7,1.52 80.16,1.52 v81.08,2.44
  Bottom 0.152: v71.63,1.07 v64.31,8.38 | v81.08,2.44 81.99,1.52 86.26,1.52 90.37,5.64 99.06,5.64 101.96,2.74 102.11,2.74 102.56,2.29 BATTERY1.1

### Text on the board
Top: piezo-rev-F